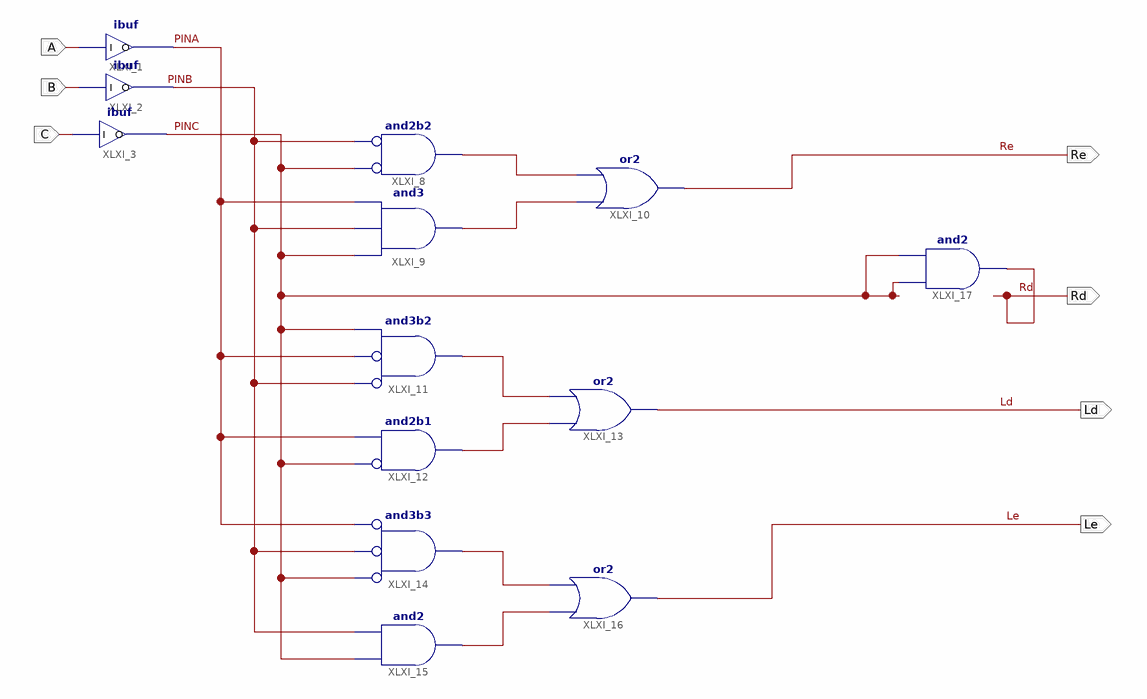
[diagram p0: schematic sheet 1]
// Xilinx ISE schematic section3_schematic.sch (xc9500xl) as structural Verilog: 13 symbols, 7 ports
module section3_schematic (
  input  B,
  input  C,
  input  A,
  output Re,
  output Ld,
  output Rd,
  output Le
);

  wire PINA, PINB, PINC, XLXN_8, XLXN_9, XLXN_26, XLXN_27, XLXN_34, XLXN_35;

  ibuf XLXI_1 (.I(A), .O(PINA));
  ibuf XLXI_2 (.I(B), .O(PINB));
  ibuf XLXI_3 (.I(C), .O(PINC));
  and XLXI_8 (XLXN_8, ~PINC, ~PINB);  // and2b2
  and XLXI_9 (XLXN_9, PINC, PINB, PINA);
  or XLXI_10 (Re, XLXN_9, XLXN_8);
  and XLXI_11 (XLXN_26, ~PINB, ~PINA, PINC);  // and3b2
  and XLXI_12 (XLXN_27, ~PINC, PINA);  // and2b1
  or XLXI_13 (Ld, XLXN_27, XLXN_26);
  and XLXI_14 (XLXN_34, ~PINC, ~PINB, ~PINA);  // and3b3
  and XLXI_15 (XLXN_35, PINC, PINB);
  or XLXI_16 (Le, XLXN_35, XLXN_34);
  and XLXI_17 (Rd, PINC, PINC);
endmodule
